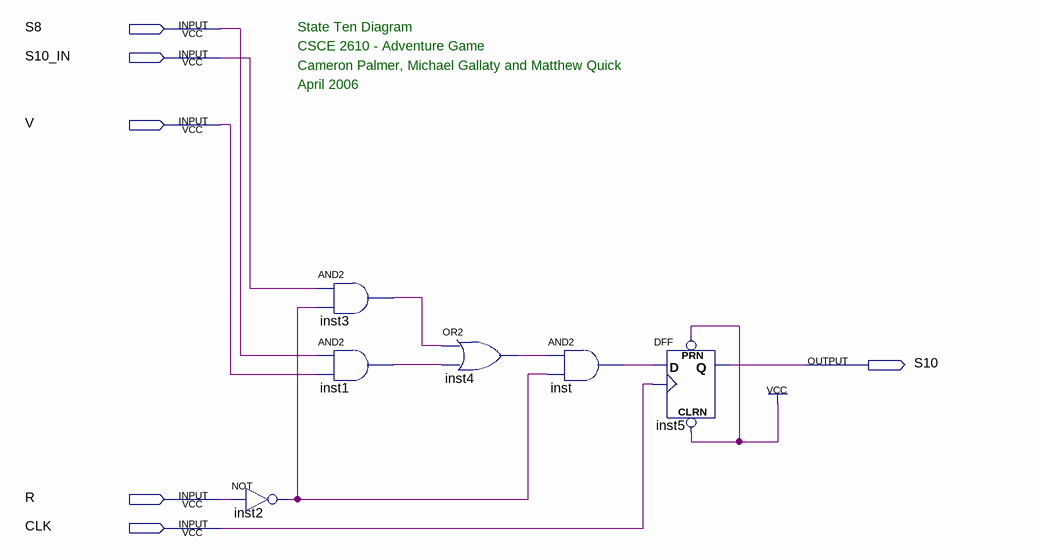
[diagram p0: schematic sheet]
// Quartus schematic state_ten.bdf as structural Verilog: 6 symbols, 6 pins
module state_ten (
  input  S8,
  input  S10_IN,
  input  V,
  input  R,
  input  CLK,
  output S10
);

  wire inst1_out, inst2_out, inst3_out, inst4_out, inst_out;

  not inst2 (inst2_out, R);
  and inst3 (inst3_out, S10_IN, inst2_out);
  and inst1 (inst1_out, S8, V);
  or inst4 (inst4_out, inst3_out, inst1_out);
  and inst (inst_out, inst4_out, inst2_out);
  DFF inst5 (.CLRN(1'b1), .CLK(CLK), .D(inst_out), .PRN(1'b1), .Q(S10));

  // Notes on the sheet:
  //   State Ten Diagram
  //   CSCE 2610 - Adventure Game
  //   Cameron Palmer, Michael Gallaty and Matthew Quick
  //   April 2006
endmodule
